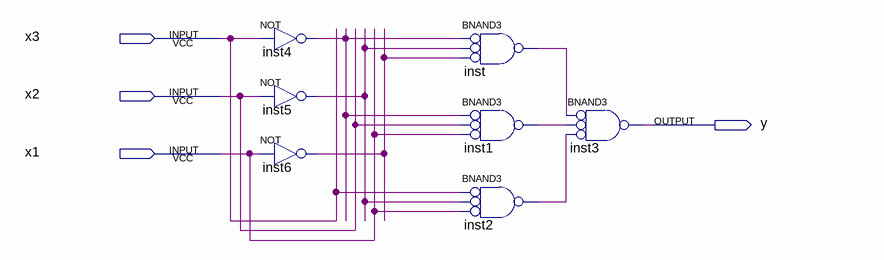
[diagram p0: schematic sheet]
// Quartus schematic LC1_Lab1_DDNF.bdf as structural Verilog: 7 symbols, 4 pins
module LC1_Lab1_DDNF (
  input  x3,
  input  x2,
  input  x1,
  output y
);

  wire inst1_out, inst2_out, inst4_out, inst5_out, inst6_out, inst_out;

  not inst4 (inst4_out, x3);
  not inst5 (inst5_out, x2);
  not inst6 (inst6_out, x1);
  nand inst (inst_out, ~inst4_out, ~inst5_out, ~inst6_out);  // BNAND3
  nand inst1 (inst1_out, ~inst4_out, ~x2, ~x1);  // BNAND3
  nand inst2 (inst2_out, ~x3, ~inst5_out, ~x1);  // BNAND3
  nand inst3 (y, ~inst_out, ~inst1_out, ~inst2_out);  // BNAND3
endmodule
